# EAGLE design uRusset_Meeper_Barc (EAGLE 9.6.2)
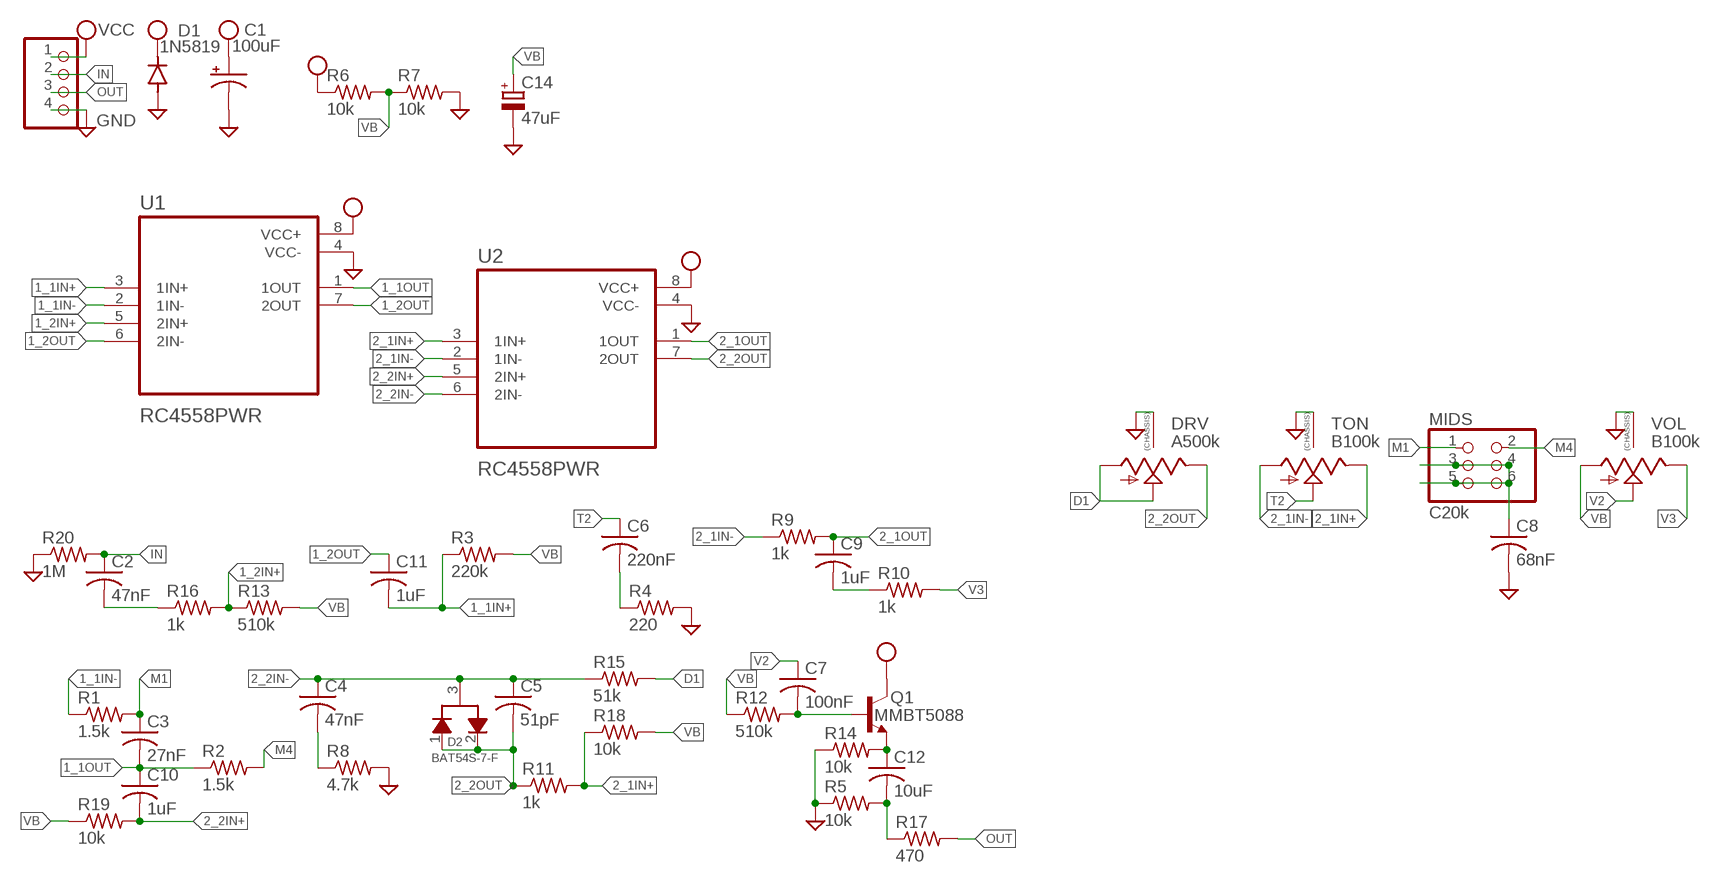
[diagram p0: schematic, sheet 1]

## Parts
C1  100uF  CAP_SMD+THRUPAN_B  [PAN_B_SMD+THRU]
C2  47nF  C-USC0603  [C0603]
C3  27nF  C-USC0603  [C0603]
C4  47nF  C-USC0603  [C0603]
C5  51pF  C-USC0603  [C0603]
C6  220nF  C-USC0603  [C0603]
C7  100nF  C-USC0603  [C0603]
C8  68nF  C-USC0603  [C0603]
C9  1uF  C-USC0805  [C0805]
C10  1uF  C-USC0805  [C0805]
C11  1uF  C-USC0805  [C0805]
C12  10uF  C-USC1206  [C1206]
C14  47uF  C-POL_TANTALUM-1206(3216-METRIC)  [CAPMP3216X180N]
D1  1N5819  DIODE-SOD123  [SOD123]
D2  BAT54S-7-F  [SOT23-3]
DRV  A500k  9MM_SNAP-IN_POT_CHASSIS  [9MM_SNAP-IN_POT]
JP1  PINHD-1X4  [1X04]
MIDS  C20k  PINHD-2X3  [2X03]
Q1  MMBT5088  [SOT23-BEC]
R1  1.5k  R-US_R0603  [R0603]
R2  1.5k  R-US_R0603  [R0603]
R3  220k  R-US_R0603  [R0603]
R4  220  R-US_R0603  [R0603]
R5  10k  R-US_R0603  [R0603]
R6  10k  R-US_R0603  [R0603]
R7  10k  R-US_R0603  [R0603]
R8  4.7k  R-US_R0603  [R0603]
R9  1k  R-US_R0603  [R0603]
R10  1k  R-US_R0603  [R0603]
R11  1k  R-US_R0603  [R0603]
R12  510k  R-US_R0603  [R0603]
R13  510k  R-US_R0603  [R0603]
R14  10k  R-US_R0603  [R0603]
R15  51k  R-US_R0603  [R0603]
R16  1k  R-US_R0603  [R0603]
R17  470  R-US_R0603  [R0603]
R18  10k  R-US_R0603  [R0603]
R19  10k  R-US_R0603  [R0603]
R20  1M  R-US_R0603  [R0603]
TON  B100k  9MM_SNAP-IN_POT_CHASSIS  [9MM_SNAP-IN_POT]
U1  RC4558PWR  [SOP65P640X120-8N]
U2  RC4558PWR  [SOP65P640X120-8N]
VOL  B100k  9MM_SNAP-IN_POT_CHASSIS  [9MM_SNAP-IN_POT]

## Nets
1_1IN+: C11.2 R3.1 U1.3(1IN+)
1_1IN-: R1.1 U1.2(1IN-)
1_1OUT: C3.2 C10.1 R2.1 U1.1(1OUT)
1_2IN+: R13.1 R16.2 U1.5(2IN+)
1_2OUT: C11.1 U1.6(2IN-) U1.7(2OUT)
2_1IN+: R11.2 R18.1 TON.3(E) U2.3(1IN+)
2_1IN-: R9.1 TON.1(A) U2.2(1IN-)
2_1OUT: C9.1 R9.2 U2.1(1OUT)
2_2IN+: C10.2 R19.2 U2.5(2IN+)
2_2IN-: C4.1 C5.1 D2.3 R15.1 U2.6(2IN-)
2_2OUT: C5.2 D2.1 D2.2 DRV.3(E) R11.1 U2.7(2OUT)
D1: DRV.1(A) DRV.2(S) R15.2
GND: C1.- C1.--(-) C8.2 C14.2(-) D1.A DRV.CHASSIS1 DRV.CHASSIS2 JP1.4 R4.2 R5.1 R7.2 R8.2 R14.1 R20.1 TON.CHASSIS1 TON.CHASSIS2 U1.4(VCC-) U2.4(VCC-) VOL.CHASSIS1 VOL.CHASSIS2
IN: C2.1 JP1.2 R20.2
M1: C3.1 MIDS.1 R1.2
M4: MIDS.2 R2.2
N$1: C8.1 MIDS.3 MIDS.4 MIDS.5 MIDS.6
N$2: C4.2 R8.1
N$3: C2.2 R16.1
N$4: C6.2 R4.1
N$5: C9.2 R10.1
N$6: C7.2 Q1.B R12.2
N$7: C12.1 Q1.E R14.2
N$8: C12.2 R5.2 R17.1
OUT: JP1.3 R17.2
T2: C6.1 TON.2(S)
V2: C7.1 VOL.2(S)
V3: R10.2 VOL.3(E)
VB: C14.1(+) R3.2 R6.2 R7.1 R12.1 R13.2 R18.2 R19.1 VOL.1(A)
VCC: C1.+ C1.++(+) D1.C JP1.1 Q1.C R6.1 U1.8(VCC+) U2.8(VCC+)

## Library data of the parts
C1 = MusicThingModular:CAP_SMD+THRU
C2-C12 = adafruit:C-US: CAPACITOR, American symbol
C14 = Capacitor:C-POL: Capacitor Polarised - Generic; CATEGORY: Capacitor
D1 = diode:DIODE-: DIODE
D2 = Diodes:BAT54S-7-F: DIODE ARRAY SCHOTTKY 30V SOT23-3 Manufacturer's datasheet <https://www.diodes.com/assets/Datasheets/ds11005.pdf>; CREATED_BY: PCBLayout.com; DIGIKEY_PART_NUMBER: BAT54S-FDITR-ND; MANUFACTURER: Diodes Incorporated; MPN: BAT54S-7-F; PACKAGE: SOT-23
DRV TON VOL = MusicThingModular:9MM_SNAP-IN_POT_CHASSIS: 9mm vertical snap-in pot, Alpha / Panasonic style, with a connection to the metal chassis for grounding
JP1 = Connector:PINHD-1X4: PIN HEADER; CATEGORY: CONNECTOR; SUB-CATEGORY: PIN-HEADER
MIDS = pinhead:PINHD-2X3: PIN HEADER
Q1 = MMBT5088_:MMBT5088*: NPN TRANSISTOR Check prices <https://pricing.snapeda.com/search/part/MMBT5088/?ref=eda>; AVAILABILITY: Good; DESCRIPTION: Bipolar (BJT) Transistor NPN 30V 100mA 50MHz 350mW Surface Mount SOT-23; MF: ON Semiconductor; MP: MMBT5088; PACKAGE: SOT-23-3 Fairchild Semiconductor; PRICE: None; PURCHASE-URL: https://pricing.snapeda.com/search/part/MMBT5088/?ref=eda
R1-R20 = adafruit:R-US_: RESISTOR, American symbol
U1 U2 = RC4558PWR:RC4558PWR: None Check prices <https://pricing.snapeda.com/search/part/RC4558PWR/?ref=eda>; AVAILABILITY: Good; DESCRIPTION: Dual General-Purpose Operational Amplifier 8-TSSOP 0 to 70; MF: Texas Instruments; MP: RC4558PWR; PACKAGE: TSSOP-8 Texas Instruments; PRICE: None; PURCHASE-URL: https://pricing.snapeda.com/search/part/RC4558PWR/?ref=eda

## Board
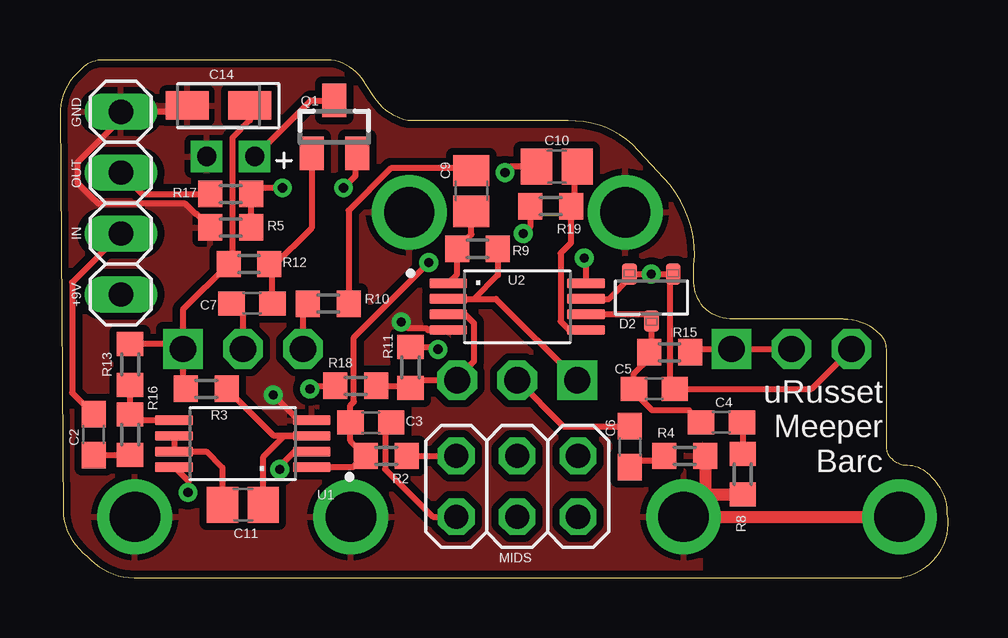
[diagram p1: board, top side]
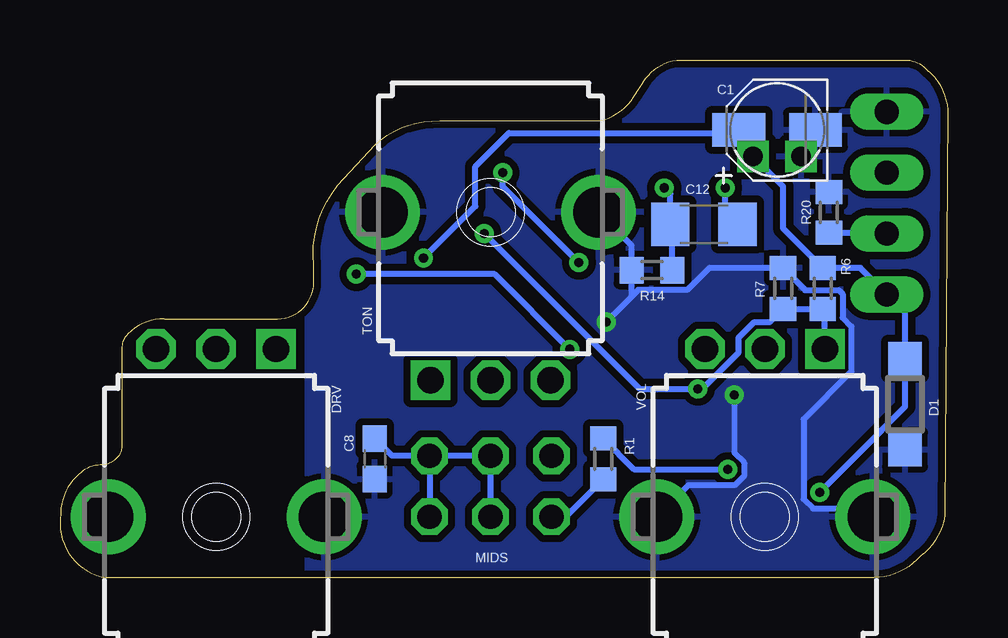
[diagram p2: board, bottom side, seen from below]

Size 36.99 x 21.59 mm. Coordinates in mm from the lower left corner, seen from the top.
Outline: 3.94,0 35.05,0 arc90 36.96,2.67 36.96,2.71 arc45 36.32,4.19 36.21,4.3 arc45 35.31,4.7 35.28,4.7 arc-45 34.67,4.95 34.6,5.03 arc-45 34.42,5.46 34.42,9.55 arc45 34.16,10.16 34.16,10.17 arc45 32.64,10.79 28.23,10.79 arc-45 26.92,11.18 26.81,11.29 arc-45 26.42,12.45 26.42,13.04 arc45 25.42,16.36 23.86,18.05 arc45 21.17,19.05 14.49,19.05 arc-45 13.08,20.07 12.57,20.83 arc45 11.29,21.59 1.78,21.59 arc45 0.91,21.23 0.87,21.19 arc45 0,19.52 0.13,2.58 arc45 1.12,0.91 1.29,0.74 arc45 3.08,0 3.94,0
Copper layers (1*16): Top 0.035mm / dielectric 1.5mm / Bottom 0.035mm
Design rules "default *": minimum track width 6mil, minimum drill 0.35mm, track to track 6mil, track to pad 6mil, pad to pad 6mil, via to via 6mil, smd to smd 6mil, copper to edge 10mil, drill to drill 6mil, minimum pad ring 10mil, minimum via ring 8mil, stop-mask expansion 4mil, vias tented up to drill 0mil, thermal gap 10mil

### Footprints (pad centres in the part's own frame; a part is rotated, then mirrored left to right if it is on the bottom)
PAN_B_SMD+THRU = smd 2.2 x 1.4: + 1.6,0; - -1.6,0 | drill 0.8 pad 0.9 square: ++ 1,1.1; -- -1,1.1
C0603 = smd 1.1 x 1: 1 -0.85,0; 2 0.85,0
C0805 = smd 1.3 x 1.5: 1 -0.85,0; 2 0.85,0
C1206 = smd 1.6 x 1.8: 1 -1.4,0; 2 1.4,0
CAPMP3216X180N = smd 1.796 x 1.189: 1 -1.31,0; 2 1.31,0
SOD123 = smd 1.4 x 1.4: A 1.9,0; C -1.9,0
SOT23-3 = smd 0.63 x 0.9: 1 -0.915,-0.975; 2 0.915,-0.975; 3 0,0.975
9MM_SNAP-IN_POT = drill 1.1 square: 1 -2.5,-7 | drill 1.1 octagon: 2 0,-7; 3 2.5,-7 | drill 2.1 pad 2.794: CHASSIS1 -4.5,0; CHASSIS2 4.5,0
1X04 = drill 1.016 long: 1 -3.81,0; 2 -1.27,0; 3 1.27,0; 4 3.81,0
2X03 = drill 1.016 octagon: 1 -2.54,-1.27; 2 -2.54,1.27; 3 0,-1.27; 4 0,1.27; 5 2.54,-1.27; 6 2.54,1.27
SOT23-BEC = smd 1 x 1.4: B -0.95,-1.1; C 0,1.1; E 0.95,-1.1
R0603 = smd 1 x 1.1: 1 -0.85,0; 2 0.85,0
SOP65P640X120-8N = smd 1.57 x 0.41: 1 -2.87,0.975; 2 -2.87,0.325; 3 -2.87,-0.325; 4 -2.87,-0.975; 5 2.87,-0.975; 6 2.87,-0.325; 7 2.87,0.325; 8 2.87,0.975

### Placement (x,y rotation side)
C1  7.11,18.67 180 bottom
C2  1.4,5.97 270 top
C3  12.95,6.48 180 top
C4  27.56,6.48 0 top
C5  24.77,7.87 0 top
C6  23.75,5.46 270 top
C7  8,11.43 0 top
C8  23.88,4.95 270 bottom
C9  17.14,16.13 90 top
C10  20.7,17.14 0 top
C11  7.62,3.05 0 top
C12  10.16,14.73 0 bottom
C14  6.6,19.68 180 top
D1  1.78,7.24 270 bottom
D2  24.64,11.68 180 top
DRV  30.48,2.54 180 bottom
JP1  2.54,15.62 90 top
MIDS  19.05,3.81 0 top
Q1  11.43,18.8 0 top
R1  14.35,4.95 270 bottom
R2  13.59,5.08 0 top
R3  6.1,7.87 180 top
R4  26.04,5.08 0 top
R5  7.11,14.61 0 top
R6  5.21,12.06 270 bottom
R7  6.86,12.06 90 bottom
R8  28.45,4.32 270 top
R9  17.4,13.72 180 top
R10  11.18,11.43 180 top
R11  14.61,8.76 270 top
R12  7.87,13.08 0 top
R13  2.92,8.89 90 top
R14  12.32,12.83 0 bottom
R15  25.4,9.4 0 top
R16  2.92,5.97 90 top
R17  7.11,16 180 top
R18  12.32,8 180 top
R19  20.45,15.49 0 top
R20  4.95,15.24 270 bottom
TON  19.05,15.24 0 bottom
U1  7.62,5.59 180 top
U2  19.05,11.3 0 top
VOL  7.62,2.54 180 bottom

### Tracks (layer width: path | path; a pad name or v marks a point on that pad's centre or on a via)
1_1IN+
  Top 0.254: C11.2 8.47,5.04 9.34,5.91 U1.3 8.91,5.91 R3.1
1_1IN-  (via drill 0.38)
  Top 0.254: v9.16,4.52 9.16,4.64 9.79,5.26 U1.2
  Bottom 0.254: R1.1 13.07,4.52 v9.16,4.52
1_1OUT  (via drill 0.38)
  Top 0.254: U1.1 12.21,4.61 12.68,5.08 R2.1 12.1,5.71 C3.2 12.1,7.19 12.25,7.33 12.25,10.02 v15.37,13.14 | C10.1 18.8,17.14 v18.54,16.89
  Bottom 0.254: v15.37,13.14 18.54,16.31 v18.54,16.89
1_2IN+
  Top 0.254: U1.5 3.18,6.56 R16.2 R13.1
1_2OUT
  Top 0.254: U1.6 U1.7 6.09,5.26 6.77,4.58 C11.1
2_1IN+
  Top 0.254: R18.1 14.52,8 R11.2 14.93,8.24 TON.3 16.55,8.33 17.24,9.02 17.24,10.62 16.89,10.98 U2.3
2_1IN-
  Top 0.254: U2.2 17.27,11.63 | R9.1 18.25,12.61 17.27,11.63 | 17.27,11.63 18.16,11.63 TON.1
2_1OUT
  Top 0.254: U2.1 16.55,12.65 R9.2 17.14,14.31 C9.1
2_2IN+
  Top 0.254: C10.2 21.42,17.02 21.42,15.62 R19.2 21.3,13.97 20.86,13.53 20.86,10.69 21.21,10.33 U2.5
2_2IN-
  Top 0.254: U2.6 24.4,10.98 24.64,10.74 D2.3 24.64,9.49 R15.1 24.55,9.14 23.91,8.51 C5.1 23.91,7.75 24.68,6.99 26.2,6.99 C4.1
2_2OUT  (via drill 0.38)
  Top 0.254: U2.7 22.88,11.63 23.72,12.47 D2.2 v24.64,12.66 D2.1 25.4,12.51 25.4,8.09 C5.2 31.31,7.87 DRV.3 | R11.1 15.66,9.61 v15.75,9.53
  Bottom 0.254: v15.75,9.53 18.88,12.66 v24.64,12.66
D1
  Top 0.254: R15.2 26.39,9.54 DRV.1 DRV.2
GND  (via drill 0.38)
  Top 0.254: U2.4 15.34,10.33 15.27,10.39 14.5,10.39 v14.22,10.67 | R5.1 5.69,15.17 5.65,15.17 5.22,15.6 1.6,15.6 0.74,16.46 0.74,17.32 2.54,19.13 JP1.4 5.04,19.43 C14.2 | 28.45,3.52 R8.2 | U1.4 9.95,6.56 v8.89,7.62
  Top 0.508: 26.89,3.44 26.91,3.47 R8.2 | R4.2 26.89,3.44 | 26.89,3.44 DRV.CHASSIS1 DRV.CHASSIS2
  Bottom 0.254: v14.22,10.67 13.17,11.72 | 13.17,11.72 R14.1 13.17,13.86 TON.CHASSIS2 | 13.17,11.72 12.89,12 10.85,12 9.94,12.91 R7.2 5.94,11.99 4.54,11.99 4.38,11.83 4.38,10.84 4.02,10.48 4.02,8.6 6.01,6.61 6.01,3.28 5.61,2.88 3.46,2.88 VOL.CHASSIS1 | VOL.CHASSIS2 10.81,3.85 8.88,3.85 8.49,4.25 8.49,4.8 8.89,5.21 v8.89,7.62
  pour Bottom (isolate 0.305): -1.27,22.86 -1.27,-1.27 26.67,-1.27 26.67,22.86
  pour Top (isolate 0.305): -1.27,22.86 -1.27,-1.27 26.67,-1.27 26.67,22.86
IN
  Top 0.254: JP1.2 0.51,12.32 0.51,7.71 C2.1
  Bottom 0.254: JP1.2 2.58,14.39 R20.2
M1
  Top 0.254: C3.1 13.55,6.22 13.55,4.52 15.53,2.54 MIDS.1
  Bottom 0.254: R1.2 15.91,2.54 MIDS.1
M4
  Top 0.254: R2.2 MIDS.2
N$1
  Bottom 0.254: MIDS.6 23.15,5.08 C8.1 | MIDS.6 MIDS.5 | MIDS.3 MIDS.4 MIDS.6
N$2
  Top 0.254: C4.2 28.45,6.44 R8.1
N$3
  Top 0.254: C2.2 R16.1
N$4
  Top 0.254: R4.1 24.97,4.87 24,4.87 C6.2
N$5
  Top 0.254: C9.2 17.05,17.08 13.79,17.08 12.03,15.31 R10.1
N$6
  Top 0.254: C7.2 8.85,12.95 | 8.85,12.95 R12.2 | Q1.B 10.48,14.58 8.85,12.95
N$7  (via drill 0.38)
  Top 0.254: v11.81,16.26 12.32,16.76 12.32,17.64 Q1.E
  Bottom 0.254: R14.2 11.47,14.64 C12.1 11.56,16 v11.81,16.26
N$8  (via drill 0.38)
  Top 0.254: R5.2 R17.1 8.22,16.26 v9.27,16.26
  Bottom 0.254: C12.2 9.27,15.24 v9.27,16.26
OUT
  Top 0.254: JP1.3 3.43,16 R17.2
T2
  Top 0.254: TON.2 20.98,6.31 C6.1
V2
  Top 0.254: C7.1 7.62,10.96 VOL.2
V3
  Top 0.254: R10.2 10.12,11.22 VOL.3
VB  (via drill 0.38)
  Top 0.254: VOL.1 4.92,9.74 R13.2 | VOL.1 5.12,8 R3.2 | C14.1 7.91,19.07 7.18,18.34 7.18,13.24 R12.1 5.12,11.18 VOL.1 | v10.41,7.87 10.54,8 R18.2 | R19.1 19.6,14.64 v19.3,14.35
  Bottom 0.254: VOL.1 5.12,11.13 R6.2 R7.1 7.43,10.64 8.08,10.64 8.72,10 8.72,9.37 10.22,7.87 v10.41,7.87 12.83,7.87 v19.3,14.35
VCC  (via drill 0.38)
  Top 0.254: U1.8 5.33,4.03 v5.33,3.56 | U2.8 21.92,13.26 v21.84,13.33 | C1.++ 10.44,19.9 Q1.C
  Bottom 0.254: 8.71,18.54 8.71,18.17 C1.++ 6.86,16.32 6.86,14.57 R6.1 3.64,12.91 JP1.1 1.78,11.05 D1.C 1.78,7.13 2.76,6.16 2.76,6.13 v5.33,3.56 | 8.71,18.54 C1.+ | v21.84,13.33 19.68,15.49 19.68,17.14 18.29,18.54 8.71,18.54

### Text on the board
tPlace: GND | OUT | IN | . | +9V | uRusset / Meeper / Barc | .
bPlace: MIDS